# Altium schematic sheet 06 Gyro.SchDoc
size 152 x 139 mm
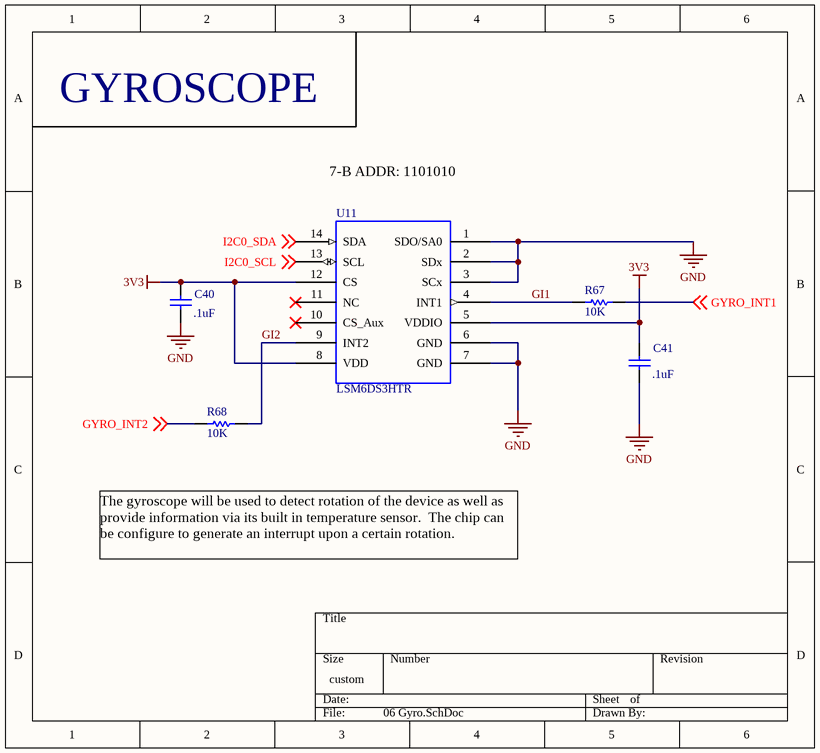
[diagram p0: 06 Gyro.SchDoc]

## Parts
C40  value .1uF  [CAPC2012X135N]  (hidden comment: CAP_0805_.1u_250V)
C41  value .1uF  [CAPC2012X135N]  (hidden comment: CAP_0805_.1u_250V)
R67  Resistance: 10K  [RES0805]  (hidden comment: RES_0805_10K)
R68  Resistance: 10K  [RES0805]  (hidden comment: RES_0805_10K)
U11  LSM6DS3HTR  [PQFN50P300X250X86_HS-15N]

## Nets
3V3: C40.2 C41.2 U11.5(VDDIO) U11.8(VDD) U11.12(CS)
GND: C40.1 C41.1 U11.1(SDO/SA0) U11.2(SDx) U11.3(SCx) U11.6(GND) U11.7(GND)
GI1: R67.1 U11.4(INT1)
GI2: R68.2 U11.9(INT2)
GYRO_INT1: R67.2 ; off-sheet GYRO_INT1
GYRO_INT2: R68.1 ; off-sheet GYRO_INT2
I2C0_SCL: U11.13(SCL) ; off-sheet I2C0_SCL
I2C0_SDA: U11.14(SDA) ; off-sheet I2C0_SDA

Not connected (* = marked no-connect by the designer): U11 10(CS_Aux)* 11(NC)*

## Notes on the sheet
- GYROSCOPE
- 7-B ADDR: 1101010
- The gyroscope will be used to detect rotation of the device as well as provide information via its built in temperature sensor.  The chip can be configure to generate an interrupt upon a certain rotation.

## Library data of the parts
C40 C41 = CAP_0805_.1u_250V: Cap Ceramic 0.1uF 250V X7T 10% SMD 0805 125C Plastic T/R; Manufacturer: TDK; Manufacturer Part Number: C2012X7T2E104K125AE; Capacitance: 100nF; Supplier 1: Digi-Key; Supplier Part Number 1: 445-8883-1-ND; Stock 1: 30376; Pricing 1: 1=0.37, 10=0.25, 100=0.1419, 500=0.1002, 1000=0.0877 (USD); Case/Package: 0805; Weight: 0.000194oz; Case Code (Metric): 2012; Case Code (Imperial): 0805; Min Operating Temperature: -55°C; Max Operating Temperature: 125°C; Package Quantity: 1; Voltage Rating: 250V; Tolerance: 10%; Packaging: Tape and Reel; Voltage Rating (DC): 250V; Dielectric: X7T; Termination: SMD/SMT; Composition: Ceramic; Length: 2mm; Height: 1.25mm; Width: 0.05inch; Thickness: 0.049inch; Depth: 1.25mm; REACH SVHC: No SVHC; ComponentLink1URL: https://datasheet.ciiva.com/24219/c2012x7t2e104k125ae-265154-24219519.pdf; ComponentLink1Description: https://datasheet.ciiva.com/24219/c2012x7t2e104k125ae-265154-24219519.pdf
R67 R68 = RES_0805_10K: RES, THICK FILM, 10K, 5%, 0.125W, 0805; Manufacturer: Yageo; Manufacturer Part Number: RC0805JR-0710KL; Power Rating: 125mW; Voltage Rating: 150V; Temperature Coefficient: 100ppm/°C; Supplier 1: Digi-Key; Stock 1: 1285290; Pricing 1: 1=0.1, 10=0.019, 100=0.0076, 1000=0.0034, 2500=0.003 (USD); Case/Package: 0805; Case Code (Imperial): 0805; Case Code (Metric): 2012; Contact Plating: Tin,Matte; Min Operating Temperature: -55°C; Max Operating Temperature: 155°C; Tolerance: 5%; Packaging: Tape and Reel; Termination: SMD/SMT; Composition: Thick Film; Military Standard: Not; Length: 2mm; Height: 0.5mm; Depth: 1.25mm; Width: 1.25mm; Radiation Hardening: No; REACH SVHC: Unknown; Lead Free: Lead Free; ComponentLink1URL: https://datasheet.ciiva.com/7983/444164-7983765.pdf; ComponentLink1Description: https://datasheet.ciiva.com/7983/444164-7983765.pdf; ComponentLink2URL: https://datasheet.ciiva.com/7941/444164-7941870.pdf; ComponentLink2Description: https://datasheet.ciiva.com/7941/444164-7941870.pdf; ComponentLink3URL: https://datasheet.ciiva.com/7941/444164-7941871.pdf; ComponentLink3Description: https://datasheet.ciiva.com/7941/444164-7941871.pdf; Supplier Part Number 1: 311-10KARCT-ND
U11 = LSM6DS3HTR: Accelerometer and Gyroscope 14-Pin LGA T/R; Manufacturer: STMicroelectronics; Supplier 1: Digi-Key; Stock 1: 31997; Pricing 1: 1=3.98, 10=3.572, 100=2.9264 (USD); Mount: Surface Mount; Contact Plating: Nickel,Gold; Min Operating Temperature: -40°C; Max Operating Temperature: 85°C; Packaging: Tape and Reel; Lead Free: Lead Free; ComponentLink1URL: http://www.st.com/content/ccc/resource/technical/document/datasheet/group0/38/96/79/af/ab/62/42/c3/DM00229854/files/DM00229854.pdf/jcr:content/translations/en.DM00229854.pdf; ComponentLink1Description: http://www.st.com/content/ccc/resource/technical/document/datasheet/group0/38/96/79/af/ab/62/42/c3/DM00229854/files/DM00229854.pdf/jcr:content/translations/en.DM00229854.pdf; Supplier Part Number 1: 497-16367-1-ND; Manufacturer Part Number: LSM6DS3HTR